# EAGLE schematic waga_can (EAGLE 7.7.0)

## Sheet 1 of 2
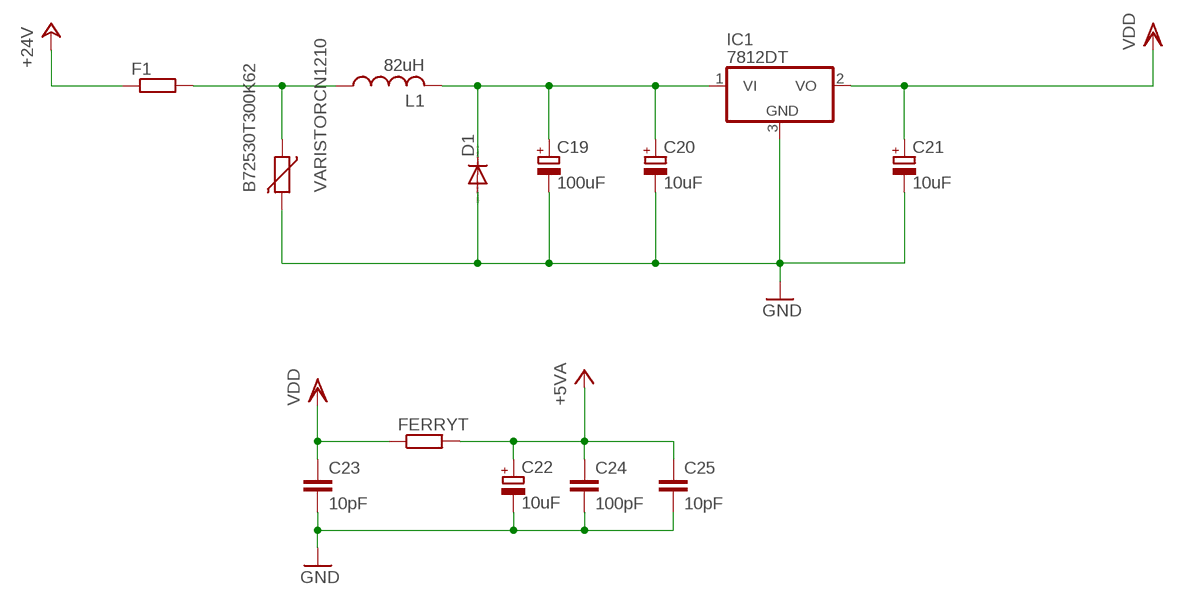
[diagram p0: schematic, sheet 1]

### Parts
B72530T300K62  VARISTORCN1210  [CT/CN1210]
C19  100uF  CPOL-EU153CLV-0810  [153CLV-0810]
C20  10uF  CPOL-EU153CLV-0605  [153CLV-0605]
C21  10uF  CPOL-EU153CLV-0605  [153CLV-0605]
C22  10uF  CPOL-EU153CLV-0605  [153CLV-0605]
C23  10pF  C-EUC0805  [C0805]
C24  100pF  C-EUC0805  [C0805]
C25  10pF  C-EUC0805  [C0805]
D1  DIODE-SMB  [SMB]
F1  R-EU_1812X7R  [1812X7R]
FERRYT  R-EU_M0805  [M0805]
IC1  7812DT  [TO252]
L1  82uH  L-USL4532P  [L4532P]

### Nets
+5V: C22.+ C24.1 C25.1 FERRYT.2 ; supply symbol labelled +5VA ; also sheet 2
+24V: F1.1 ; also sheet 2
GND: B72530T300K62.2 C19.- C20.- C21.- C22.- C23.2 C24.2 C25.2 D1.A IC1.3(GND) ; also sheet 2
N$1: C19.+ C20.+ D1.C IC1.1(VI) L1.2
N$2: B72530T300K62.1 F1.2 L1.1
VDD: C21.+ C23.1 FERRYT.1 IC1.2(VO) ; also sheet 2

## Sheet 2 of 2
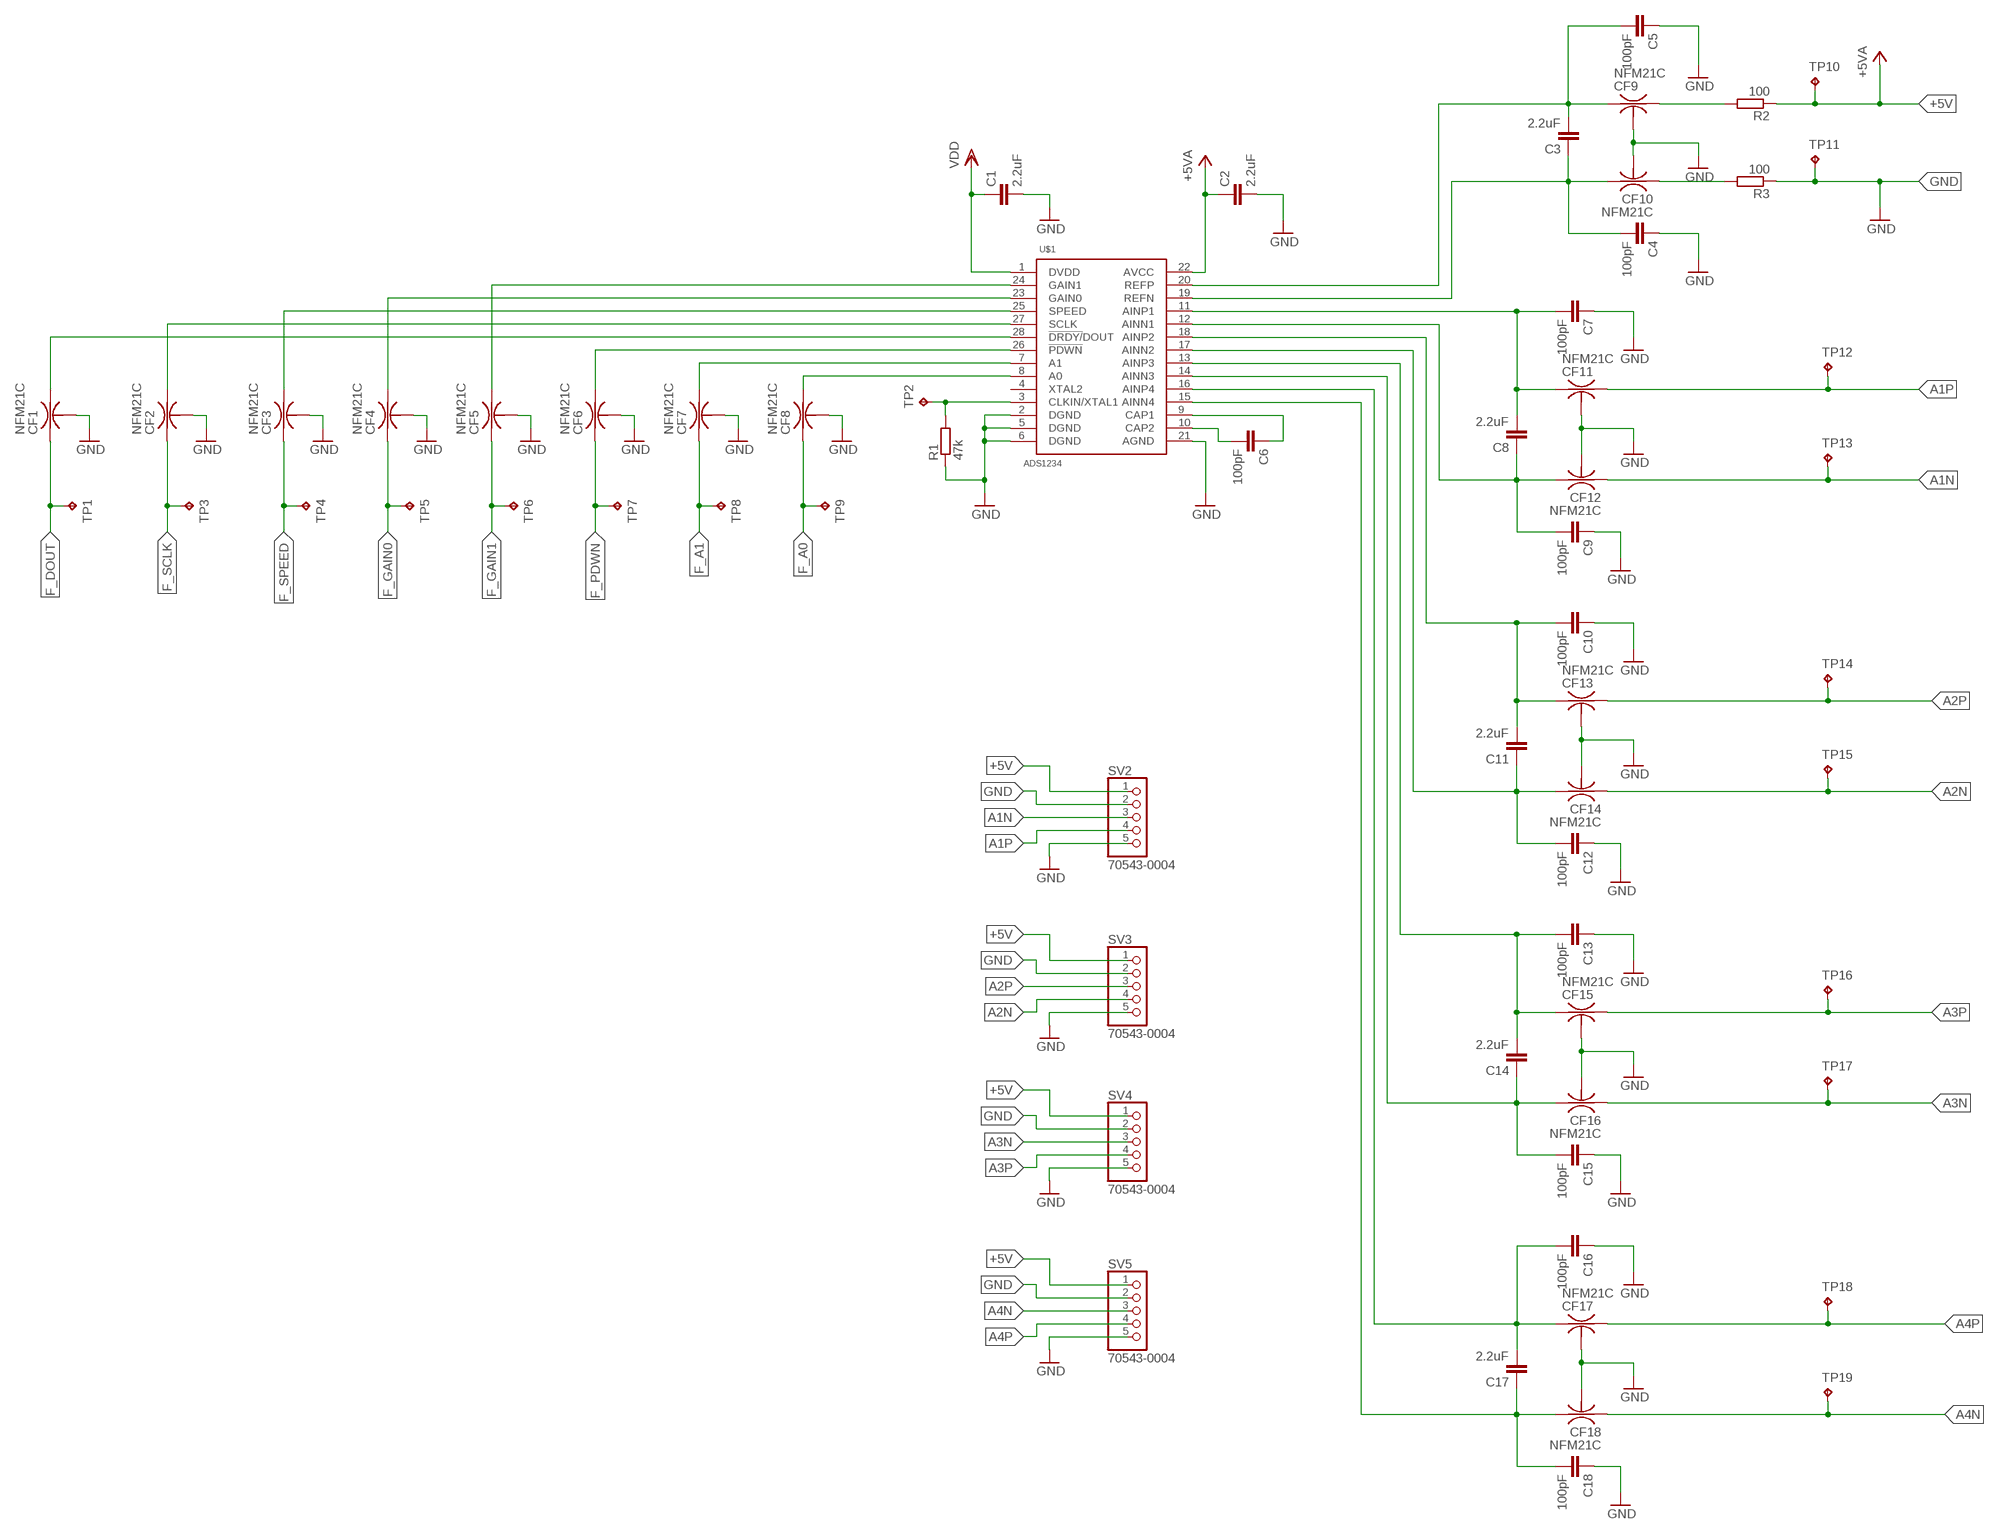
[diagram p1: schematic, sheet 2, part 1 of 2]
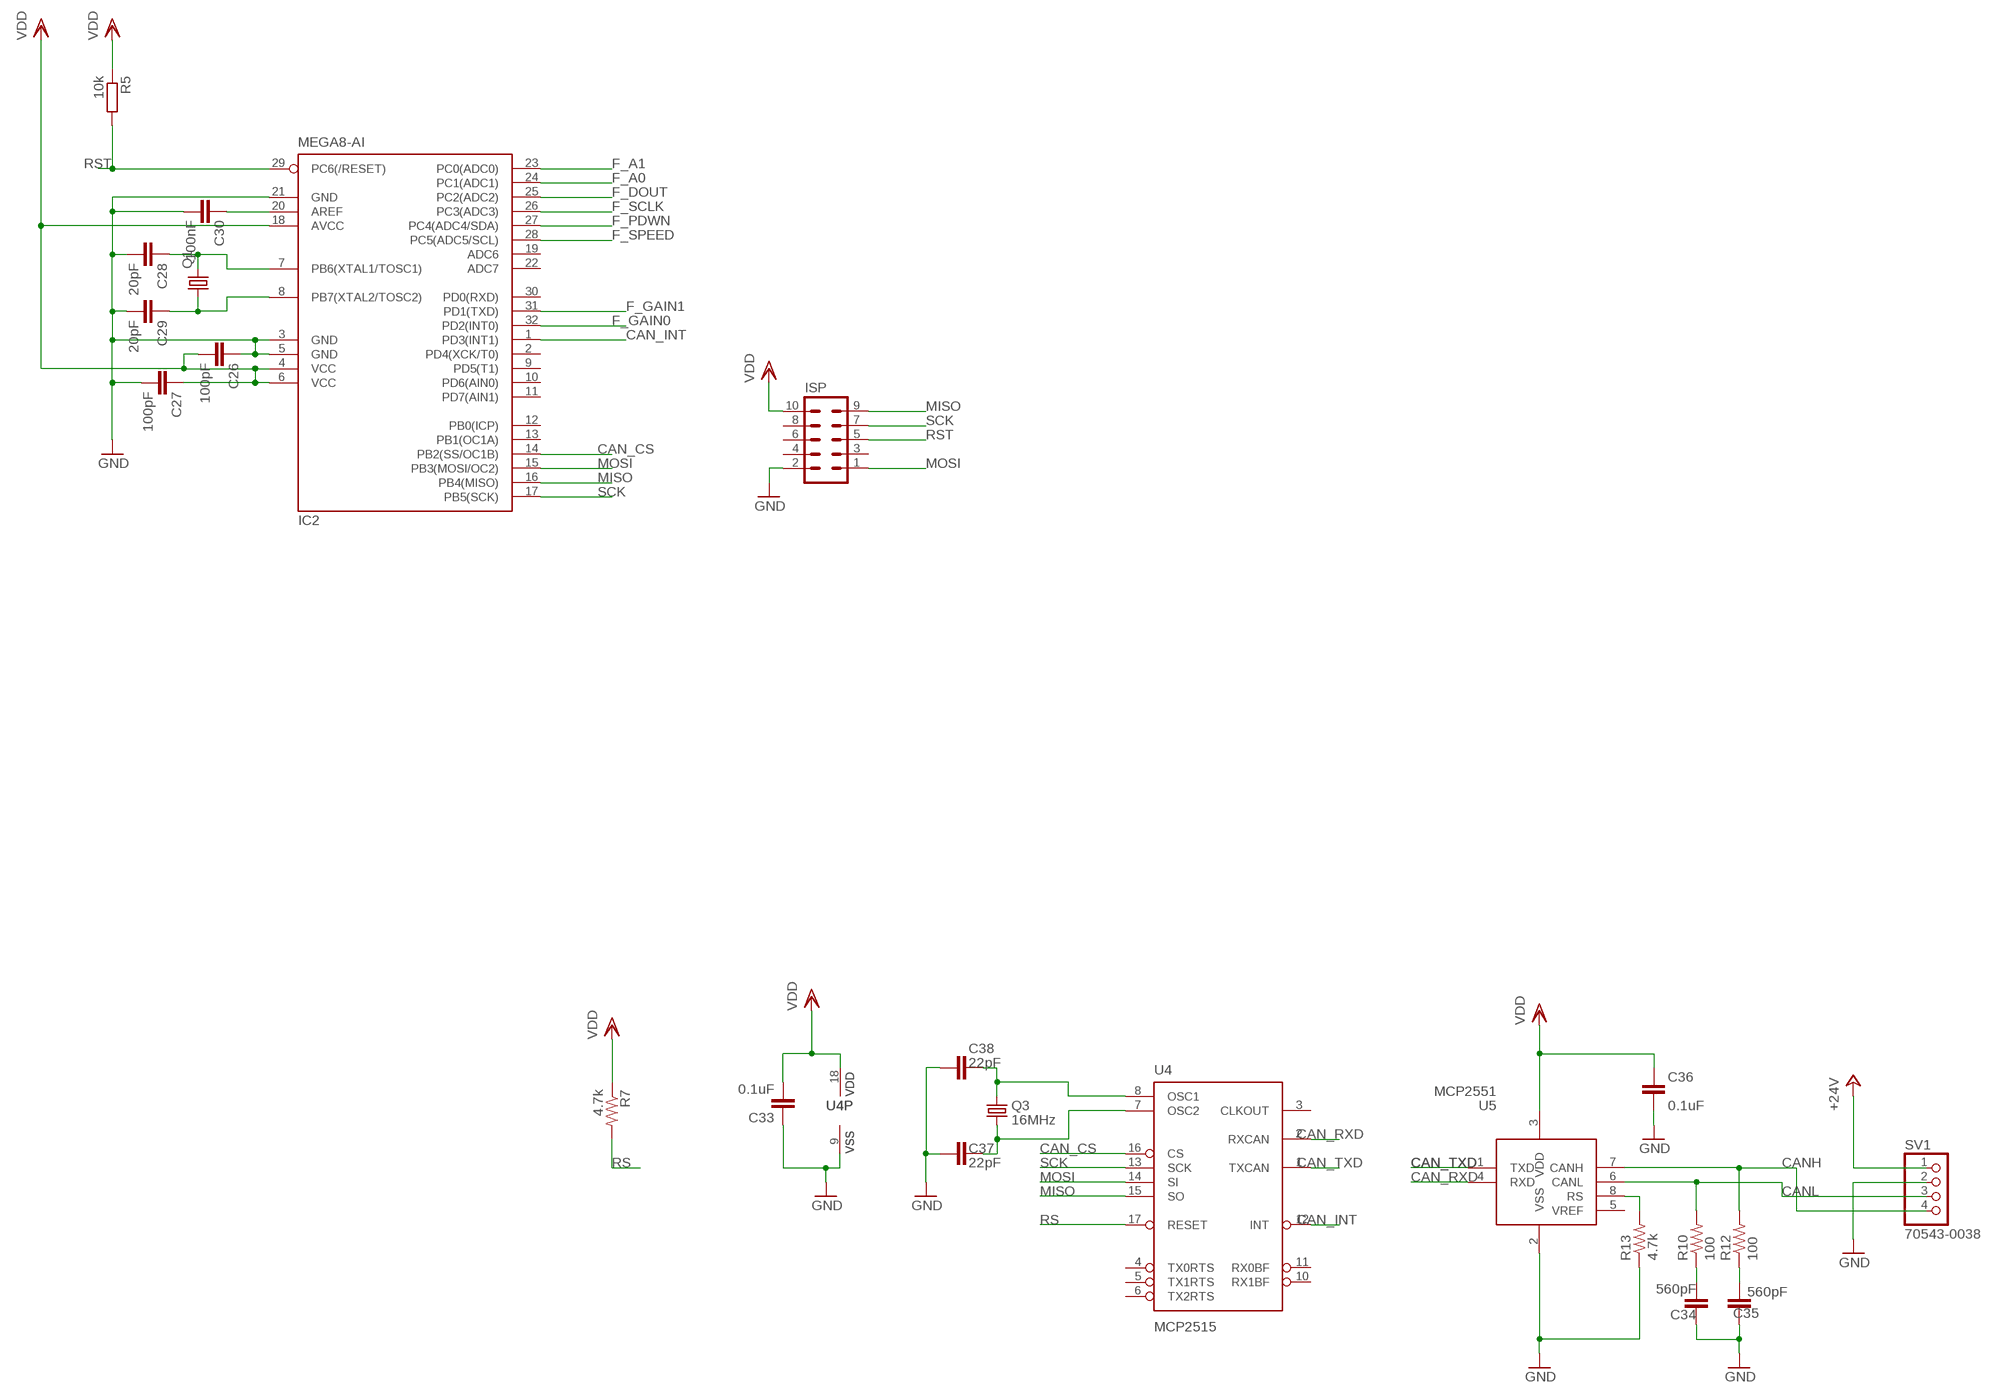
[diagram p2: schematic, sheet 2, part 2 of 2]

### Parts
C1  2.2uF  C-EUC0805K  [C0805K]
C2  2.2uF  C-EUC0805K  [C0805K]
C3  2.2uF  C-EUC0805K  [C0805K]
C4  100pF  C-EUC0805K  [C0805K]
C5  100pF  C-EUC0805K  [C0805K]
C6  100pF  C-EUC0805K  [C0805K]
C7  100pF  C-EUC0805K  [C0805K]
C8  2.2uF  C-EUC0805K  [C0805K]
C9  100pF  C-EUC0805K  [C0805K]
C10  100pF  C-EUC0805K  [C0805K]
C11  2.2uF  C-EUC0805K  [C0805K]
C12  100pF  C-EUC0805K  [C0805K]
C13  100pF  C-EUC0805K  [C0805K]
C14  2.2uF  C-EUC0805K  [C0805K]
C15  100pF  C-EUC0805K  [C0805K]
C16  100pF  C-EUC0805K  [C0805K]
C17  2.2uF  C-EUC0805K  [C0805K]
C18  100pF  C-EUC0805K  [C0805K]
C26  100pF  C-EUC0805K  [C0805K]
C27  100pF  C-EUC0805K  [C0805K]
C28  20pF  C-EUC0805K  [C0805K]
C29  20pF  C-EUC0805K  [C0805K]
C30  100nF  C-EUC0805K  [C0805K]
C33  0.1uF  CAP0603-CAP  [0603-CAP]
C34  560pF  CAP0603-CAP  [0603-CAP]
C35  560pF  CAP0603-CAP  [0603-CAP]
C36  0.1uF  CAP0603-CAP  [0603-CAP]
C37  22pF  CAP0603-CAP  [0603-CAP]
C38  22pF  CAP0603-CAP  [0603-CAP]
CF1  NFM21C  [NFM21C]
CF2  NFM21C  [NFM21C]
CF3  NFM21C  [NFM21C]
CF4  NFM21C  [NFM21C]
CF5  NFM21C  [NFM21C]
CF6  NFM21C  [NFM21C]
CF7  NFM21C  [NFM21C]
CF8  NFM21C  [NFM21C]
CF9  NFM21C  [NFM21C]
CF10  NFM21C  [NFM21C]
CF11  NFM21C  [NFM21C]
CF12  NFM21C  [NFM21C]
CF13  NFM21C  [NFM21C]
CF14  NFM21C  [NFM21C]
CF15  NFM21C  [NFM21C]
CF16  NFM21C  [NFM21C]
CF17  NFM21C  [NFM21C]
CF18  NFM21C  [NFM21C]
IC2  MEGA8-AI  [TQFP32-08]
ISP  ML10  [ML10]
Q1  CRYSTALCTS406  [CTS406]
Q3  16MHz  CRYSTAL5X3  [CRYSTAL-SMD-5X3]
R1  47k  R-EU_R0805  [R0805]
R2  100  R-EU_R0805  [R0805]
R3  100  R-EU_R0805  [R0805]
R5  10k  R-EU_R0805  [R0805]
R7  4.7k  RESISTOR0603-RES  [0603-RES]
R10  100  RESISTOR0603-RES  [0603-RES]
R12  100  RESISTOR0603-RES  [0603-RES]
R13  4.7k  RESISTOR0603-RES  [0603-RES]
SV1  70543-0038  [70543-0038]
SV2  70543-0004  [70543-0004]
SV3  70543-0004  [70543-0004]
SV4  70543-0004  [70543-0004]
SV5  70543-0004  [70543-0004]
TP1  TPTP06R  [TP06R]
TP2  TPTP06R  [TP06R]
TP3  TPTP06R  [TP06R]
TP4  TPTP06R  [TP06R]
TP5  TPTP06R  [TP06R]
TP6  TPTP06R  [TP06R]
TP7  TPTP06R  [TP06R]
TP8  TPTP06R  [TP06R]
TP9  TPTP06R  [TP06R]
TP10  TPTP06R  [TP06R]
TP11  TPTP06R  [TP06R]
TP12  TPTP06R  [TP06R]
TP13  TPTP06R  [TP06R]
TP14  TPTP06R  [TP06R]
TP15  TPTP06R  [TP06R]
TP16  TPTP06R  [TP06R]
TP17  TPTP06R  [TP06R]
TP18  TPTP06R  [TP06R]
TP19  TPTP06R  [TP06R]
U4  MCP2515  MCP2510SO  [SO-18W]
U5  MCP2551  [SO-08M]
U$1  ADS1234  [TSSOP-28]

### Nets
+5V: C2.1 R2.1 SV2.1 SV3.1 SV4.1 SV5.1 TP10.TP U$1.22(AVCC) ; supply symbol labelled +5VA ; also sheet 1
+24V: SV1.1 ; also sheet 1
A0: CF8.3 U$1.8(A0)
A1: CF6.3 U$1.26(!PDWN)
A1N: CF12.1 SV2.3 TP13.TP
A1P: CF11.3 SV2.4 TP12.TP
A2N: CF14.1 SV3.4 TP15.TP
A2P: CF13.3 SV3.3 TP14.TP
A3N: CF16.1 SV4.3 TP17.TP
A3P: CF15.3 SV4.4 TP16.TP
A4N: CF18.1 SV5.3 TP19.TP
A4P: CF17.3 SV5.4 TP18.TP
CAN_CS: IC2.14(PB2(SS/OC1B)) U4.16(CS)
CAN_INT: IC2.1(PD3(INT1)) U4.12(INT)
CAN_RXD: U4.2(RXCAN) U5.4(RXD)
CAN_TXD: U4.1(TXCAN) U5.1(TXD)
CANH: R12.2 SV1.4 U5.7(CANH)
CANL: R10.2 SV1.3 U5.6(CANL)
DOUT: CF1.3 U$1.28(!DRDY/!DOUT)
F_A0: CF8.1 IC2.24(PC1(ADC1)) TP9.TP
F_A1: CF7.1 IC2.23(PC0(ADC0)) TP8.TP
F_DOUT: CF1.1 IC2.25(PC2(ADC2)) TP1.TP
F_GAIN0: CF4.1 IC2.32(PD2(INT0)) TP5.TP
F_GAIN1: CF5.1 IC2.31(PD1(TXD)) TP6.TP
F_PDWN: CF6.1 IC2.27(PC4(ADC4/SDA)) TP7.TP
F_SCLK: CF2.1 IC2.26(PC3(ADC3)) TP3.TP
F_SPEED: CF3.1 IC2.28(PC5(ADC5/SCL)) TP4.TP
GAIN0: CF4.3 U$1.23(GAIN0)
GAIN1: CF5.3 U$1.24(GAIN1)
GND: C1.2 C2.2 C4.1 C5.1 C7.1 C9.1 C10.1 C12.1 C13.1 C15.1 C16.1 C18.1 C26.1 C27.2 C28.2 C29.2 C30.2 C33.1 C34.1 C35.1 C36.1 C37.1 C38.1 CF1.2@1 CF1.2@2 CF2.2@1 CF2.2@2 CF3.2@1 CF3.2@2 CF4.2@1 CF4.2@2 CF5.2@1 CF5.2@2 CF6.2@1 CF6.2@2 CF7.2@1 CF7.2@2 CF8.2@1 CF8.2@2 CF9.2@1 CF9.2@2 CF10.2@1 CF10.2@2 CF11.2@1 CF11.2@2 CF12.2@1 CF12.2@2 CF13.2@1 CF13.2@2 CF14.2@1 CF14.2@2 CF15.2@1 CF15.2@2 CF16.2@1 CF16.2@2 CF17.2@1 CF17.2@2 CF18.2@1 CF18.2@2 IC2.3(GND) IC2.5(GND) IC2.21(GND) ISP.2 R1.1 R3.1 R13.1 SV1.2 SV2.2 SV2.5 SV3.2 SV3.5 SV4.2 SV4.5 SV5.2 SV5.5 TP11.TP U4.9(VSS) U5.2(VSS) U$1.2(DGND) U$1.5(DGND) U$1.6(DGND) U$1.21(AGND) ; also sheet 1
MISO: IC2.16(PB4(MISO)) ISP.9 U4.15(SO)
MOSI: IC2.15(PB3(MOSI/OC2)) ISP.1 U4.14(SI)
N$3: C30.1 IC2.20(AREF)
N$5: C34.2 R10.1
N$7: CF7.3 U$1.7(A1)
N$8: C28.1 IC2.7(PB6(XTAL1/TOSC1)) Q1.3
N$9: R1.2 TP2.TP U$1.3(CLKIN/XTAL1)
N$10: C29.1 IC2.8(PB7(XTAL2/TOSC2)) Q1.1
N$11: C3.2 C5.2 CF9.1 U$1.20(REFP)
N$12: C3.1 C4.2 CF10.3 U$1.19(REFN)
N$14: C14.1 C15.2 CF16.3 U$1.14(AINN3)
N$15: CF9.3 R2.2
N$16: CF10.1 R3.2
N$17: C6.2 U$1.10(CAP2)
N$18: C6.1 U$1.9(CAP1)
N$19: C35.2 R12.1
N$21: C7.2 C8.2 CF11.1 U$1.11(AINP1)
N$22: C8.1 C9.2 CF12.3 U$1.12(AINN1)
N$23: C10.2 C11.2 CF13.1 U$1.18(AINP2)
N$24: C11.1 C12.2 CF14.3 U$1.17(AINN2)
N$25: R13.2 U5.8(RS)
N$27: C13.2 C14.2 CF15.1 U$1.13(AINP3)
N$29: C38.2 Q3.3 U4.8(OSC1)
N$31: C37.2 Q3.1 U4.7(OSC2)
N$35: C16.2 C17.2 CF17.1 U$1.16(AINP4)
N$37: C17.1 C18.2 CF18.3 U$1.15(AINN4)
RS: R7.2 U4.17(RESET)
RST: IC2.29(PC6(/RESET)) ISP.5 R5.2
SCK: IC2.17(PB5(SCK)) ISP.7 U4.13(SCK)
SCLK: CF2.3 U$1.27(SCLK)
SPEED: CF3.3 U$1.25(SPEED)
VDD: C1.1 C26.2 C27.1 C33.2 C36.2 IC2.4(VCC) IC2.6(VCC) IC2.18(AVCC) ISP.10 R5.1 R7.1 U4.18(VDD) U5.3(VDD) U$1.1(DVDD) ; also sheet 1
Unconnected: IC2.2(PD4(XCK/T0)) IC2.9(PD5(T1)) IC2.10(PD6(AIN0)) IC2.11(PD7(AIN1)) IC2.12(PB0(ICP)) IC2.13(PB1(OC1A)) IC2.19(ADC6) IC2.22(ADC7) IC2.30(PD0(RXD)) ISP.3 ISP.4 ISP.6 ISP.8 U4.3(CLKOUT) U4.4(TX0RTS) U4.5(TX1RTS) U4.6(TX2RTS) U4.10(RX1BF) U4.11(RX0BF) U5.5(VREF) U$1.4(XTAL2)

## Library data of the parts
B72530T300K62 = varistor:VARISTOR: VARISTOR
C1-C18 C23-C30 = rcl:C-EU: CAPACITOR, European symbol
C19-C22 = rcl:CPOL-EU: POLARIZED CAPACITOR, European symbol
C33-C38 = SparkFun:CAP: Capacitor Standard 0603 ceramic capacitor, and 0.1" leaded capacitor.
CF1-CF18 = murata-filter:NFM: EMIFIL(R) (Capacitor type) Single Circuit Type for Signal Lines Source: http://search.murata.co.jp/Ceramy/image/img/PDF/ENG/L0111S0109NFM3DC.pdf; MPN: NFM21CC102R1H3D; OC_FARNELL: 1828795; OC_NEWARK: 84R0165
D1 = diode:DIODE-: DIODE
F1 FERRYT R1-R3 R5 = rcl:R-EU_: RESISTOR, European symbol
IC1 = linear:78*: Positive VOLTAGE REGULATOR Source: http://cache.national.com/ds/LM/LM78L05.pdf http://www.fairchildsemi.com/ds/LM/LM7805.pdf
IC2 = atmel:MEGA8: MICROCONTROLLER 8 Kbytes FLASH, 1 kbytes SRAM, 512 bytes EEPROM, USART, 6-channel 10 bit ADC, 2-channel 8 bit ADC Pin compatible with Atmega48, ATMega88, ATMega168 Source: avr.lbr; MPN: ATMEGA8-16AU; OC_FARNELL: 9171371; OC_NEWARK: 73M8863
ISP = con-ml:ML10: HARTING; OC_FARNELL: unknown; OC_NEWARK: unknown
L1 = rcl:L-US: INDUCTOR, American symbol
Q1 = crystal:CRYSTAL: CRYSTAL; OC_FARNELL: unknown; OC_NEWARK: unknown
Q3 = SparkFun:CRYSTAL: Crystals Various standard crystals. Proven footprints. Spark Fun Electronics SKU : COM-00534
R7 R10 R12 R13 = SparkFun:RESISTOR: Resistor Basic schematic elements and footprints for 0603, 1206, and PTH resistors.
SV1 = molex-con:70543-0038
SV2-SV5 = molex-con:70543-0004
TP1-TP19 = testpad:TP: Test pad
U4 = microchip_can:MCP2510
U5 = skpang_lib:MCP2551
U$1 = TI-ads1234:ADS1234